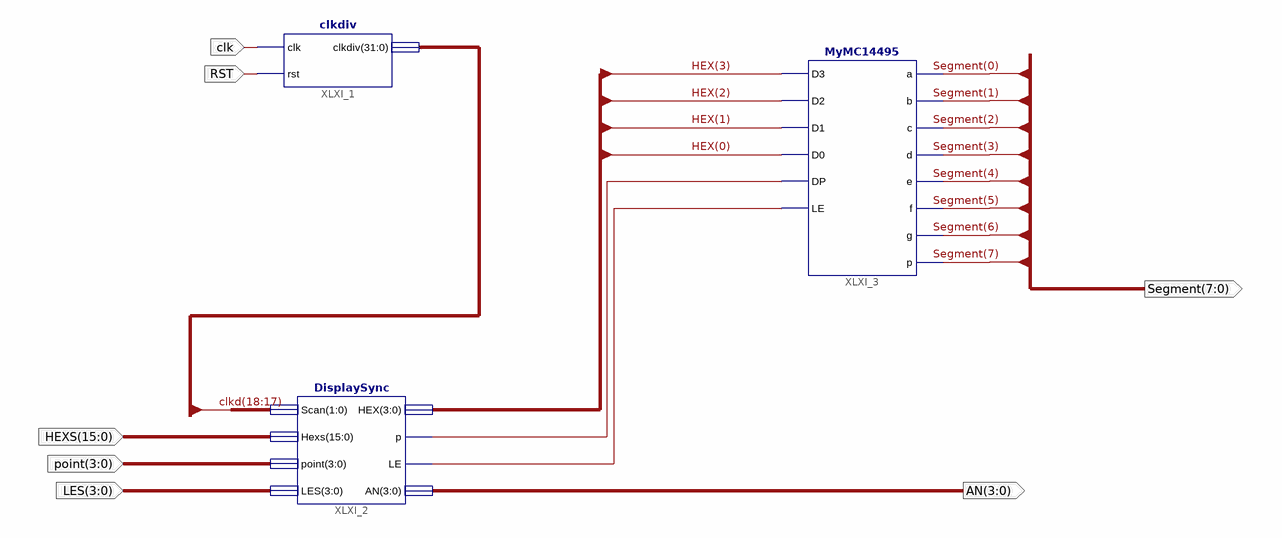
[diagram p0: schematic sheet 1]
// Xilinx ISE schematic disp_num.sch (kintex7) as structural Verilog: 3 symbols, 7 ports
module disp_num (
  input  [15:0] HEXS,
  input  [3:0] point,
  input  [3:0] LES,
  input  clk,
  input  RST,
  output [3:0] AN,
  output [7:0] Segment
);

  wire XLXN_15, XLXN_16;
  wire [3:0] HEX;
  wire [31:0] clkd;

  clkdiv XLXI_1 (.clk(clk), .rst(RST), .clkdiv(clkd));
  DisplaySync XLXI_2 (
    .Scan(clkd[18:17]), .Hexs(HEXS), .point(point), .LES(LES), .HEX(HEX), .p(XLXN_15), .LE(XLXN_16), .AN(AN));
  MyMC14495 XLXI_3 (
    .a(Segment[0]), .b(Segment[1]), .c(Segment[2]), .d(Segment[3]), .D0(HEX[0]), .D1(HEX[1]), .D2(HEX[2]),
    .D3(HEX[3]), .DP(XLXN_15), .e(Segment[4]), .f(Segment[5]), .g(Segment[6]), .LE(XLXN_16), .p(Segment[7]));
endmodule
